# EAGLE design fletchstepperjumper1 (EAGLE 7.5.0)
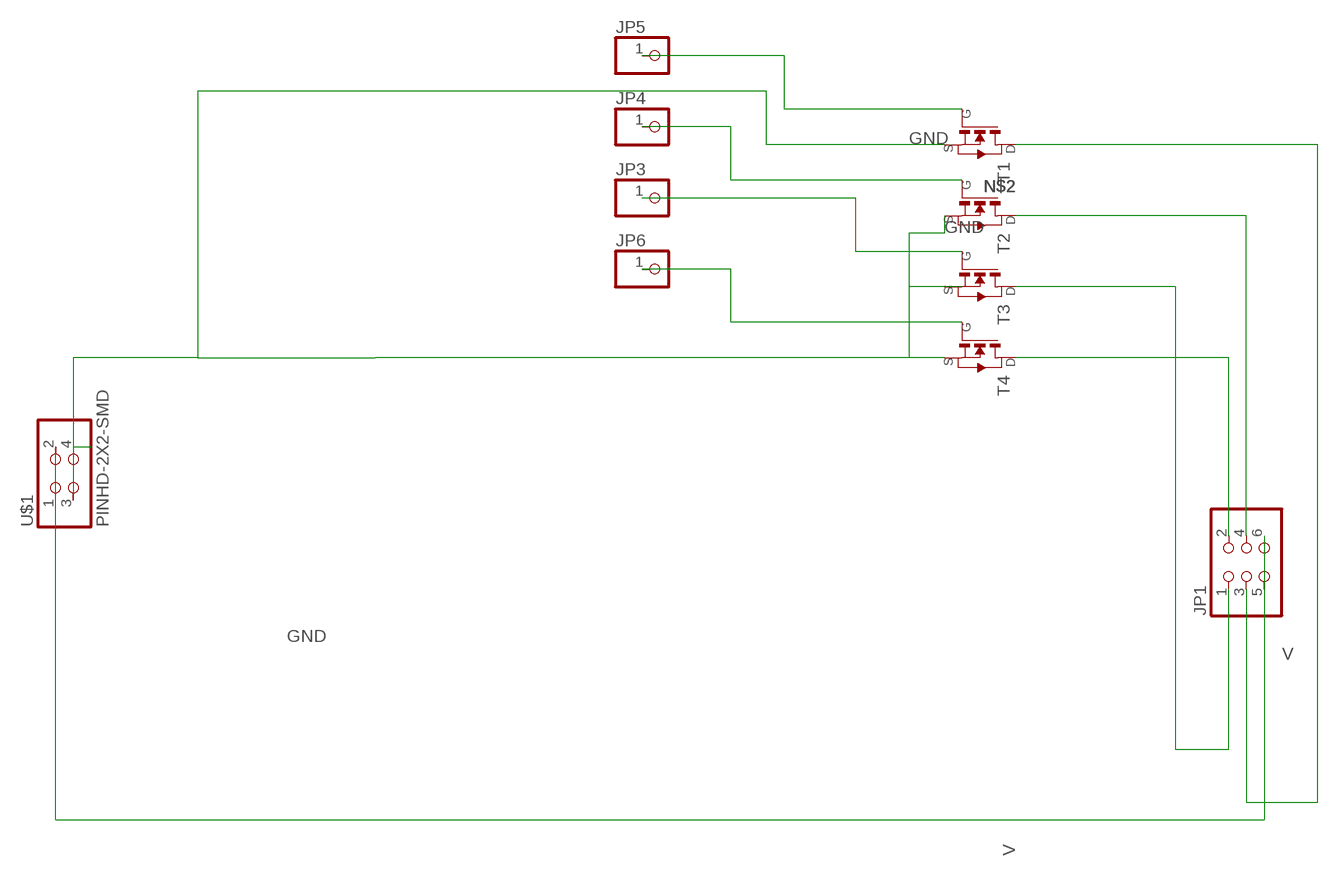
[diagram p0: schematic, sheet 1]

## Parts
JP1  PINHD-2X3-SMD  [2X03SMD]
JP3  PINHD-1X1  [1X01]
JP4  PINHD-1X1  [1X01]
JP5  PINHD-1X1  [1X01]
JP6  PINHD-1X1  [1X01]
T1  NMOSFETSOT23  [SOT-23]
T2  NMOSFETSOT23  [SOT-23]
T3  NMOSFETSOT23  [SOT-23]
T4  NMOSFETSOT23  [SOT-23]
U$1  PINHD-2X2-SMD  [2X02SMD]

## Nets
GND: T1.2(S) T2.2(S) T4.2(S) U$1.3
N$1: JP6.1 T4.3(G)
N$2: JP4.1 T2.3(G)
N$4: JP3.1 T3.3(G)
N$5: JP1.2 T4.1(D)
N$6: JP1.4 T2.1(D)
N$7: JP1.1 T3.1(D)
N$8: JP1.3 T1.1(D)
N$9: JP5.1 T1.3(G)
N$10: U$1.4
V: JP1.5 JP1.6 U$1.1 U$1.2
Unconnected: T3.2(S)

## Library data of the parts
JP1 = fab:PINHD-2X3-SMD: PIN HEADER
JP3-JP6 = adafruit:PINHD-1X1: Pin header 1x1 for 0.1" spacing With round pins
T1-T4 = fab:NMOSFET: MOS FET
U$1 = fab:PINHD-2X2-SMD

## Board
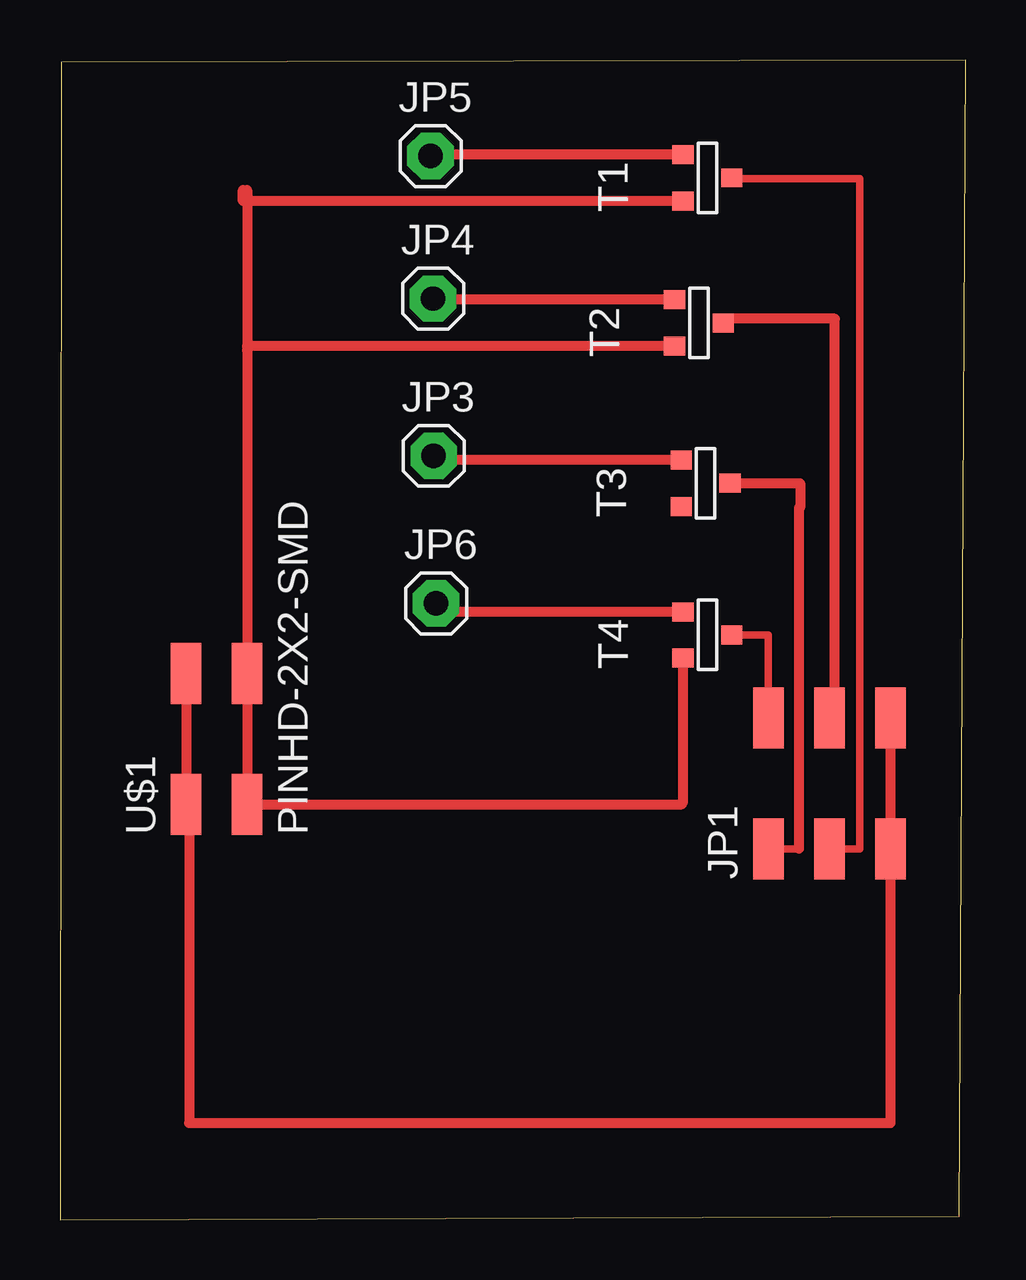
[diagram p1: board, top side]

Size 37.74 x 48.35 mm. Coordinates in mm from the lower left corner, seen from the top.
Outline: 0,0 37.46,0.15 37.74,48.35 0.05,48.25 0,0
Copper layers (1*16): Top 0.035mm / dielectric 1.5mm / Bottom 0.035mm
Design rules "default": minimum track width 10mil, minimum drill 24mil, track to track 8mil, track to pad 8mil, pad to pad 8mil, via to via 8mil, smd to smd 8mil, copper to edge 40mil, drill to drill 8mil, minimum pad ring 10mil, minimum via ring 8mil, stop-mask expansion 4mil, vias tented up to drill 0mil, thermal gap 10mil

### Footprints (pad centres in the part's own frame; a part is rotated, then mirrored left to right if it is on the bottom)
2X03SMD = smd 2.54 x 1.27: 1 -2.54,2.54; 2 2.92,2.54; 3 -2.54,0; 4 2.92,0; 5 -2.54,-2.54; 6 2.92,-2.54
1X01 = drill 1.016 pad 1.93 octagon: 1 0,0
SOT-23 = smd 0.787 x 0.889: 1 0.025,-1.016; 2 -0.94,1.016; 3 0.991,1.016
2X02SMD = smd 2.54 x 1.27: 1 -2.54,1.27; 2 2.92,1.27; 3 -2.54,-1.27; 4 2.92,-1.27

### Placement (x,y rotation side)
JP1  32.05,18.01 90 top
JP3  15.57,31.85 0 top
JP4  15.54,38.4 0 top
JP5  15.44,44.35 0 top
JP6  15.67,25.7 0 top
T1  26.97,43.41 90 top
T2  26.62,37.36 90 top
T3  26.9,30.68 90 top
T4  26.97,24.36 90 top
U$1  6.53,19.86 90 top

### Tracks (layer width: path | path; a pad name or v marks a point on that pad's centre or on a via)
GND
  Top 0.203: 25.76,23.42 T4.2
  Top 0.406: T4.2 25.96,17.42 25.91,17.42 25.91,17.32 U$1.3 7.8,36.25 7.8,36.42 | T1.2 7.62,42.47 7.62,42.93 7.8,42.93 7.8,36.42 | T2.2 7.8,36.42
N$1
  Top 0.406: T4.3 15.67,25.35 JP6.1
N$2
  Top 0.406: T2.3 15.54,38.35 JP4.1
N$4
  Top 0.406: T3.3 15.57,31.67 JP3.1
N$5
  Top 0.305: T4.1 29.51,24.38 JP1.2
N$6
  Top 0.406: JP1.4 32.28,20.93 32.28,37.57 27.63,37.57 T2.1
N$7
  Top 0.305: 30.78,15.47 JP1.1
  Top 0.406: T3.1 30.84,30.71 30.84,29.69 30.78,29.69 30.78,15.47
N$8
  Top 0.305: JP1.3 33.32,15.47 33.32,43.41 27.99,43.41 T1.1
N$9
  Top 0.406: T1.3 15.44,44.4 JP5.1
V
  Top 0.406: JP1.5 JP1.6 34.59,4.04 5.38,4.04 5.38,17.32 U$1.1 U$1.2